# EAGLE design atmega_midi_x0x_heart (EAGLE 7.1.0)
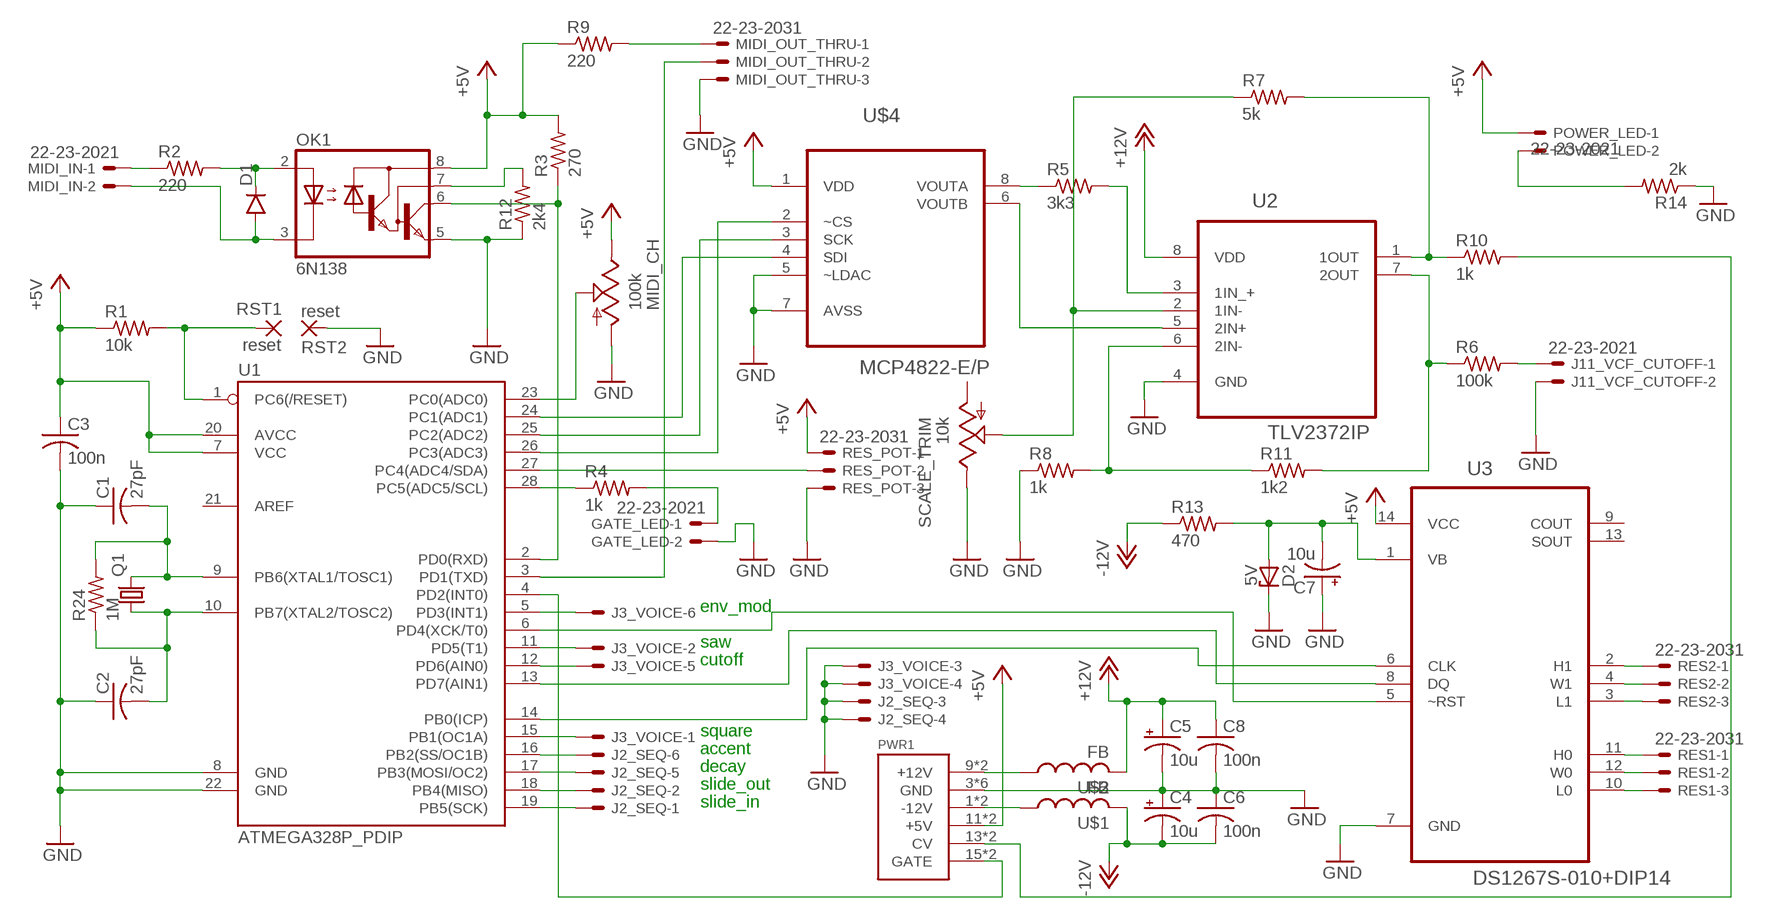
[diagram p0: schematic, sheet 1]

## Parts
C1  27pF  C-US050-024X044  [C050-024X044]
C2  27pF  C-US050-024X044  [C050-024X044]
C3  100n  C-US050-024X044  [C050-024X044]
C4  10u  CPOL-USB45181A  [B45181A]
C5  10u  CPOL-USB45181A  [B45181A]
C6  100n  C-US050-024X044  [C050-024X044]
C7  10u  CPOL-USB45181B  [B45181B]
C8  100n  C-US050-024X044  [C050-024X044]
D1  DIODE1N4148  [DIODE-1N4148]
D2  5V  ZENER-DIODEDO35Z10  [DO35Z10]
GATE_LED  22-23-2021  [22-23-2021]
J2_SEQ  22-23-2061  [22-23-2061]
J3_VOICE  22-23-2061  [22-23-2061]
J11_VCF_CUTOFF  22-23-2021  [22-23-2021]
MIDI_CH  100k  TRIM_US-B64W  [B64W]
MIDI_IN  22-23-2021  [22-23-2021]
MIDI_OUT_THRU  22-23-2031  [22-23-2031]
OK1  6N138  [DIL08]
POWER_LED  22-23-2021  [22-23-2021]
PWR1  POWER  [POWER_16]
Q1  CRYSTALHC49S  [HC49/S]
R1  10k  R-US_0207/10  [0207/10]
R2  220  R-US_0207/10  [0207/10]
R3  270  R-US_0207/10  [0207/10]
R4  1k  R-US_0207/10  [0207/10]
R5  3k3  R-US_0207/10  [0207/10]
R6  100k  R-US_0207/10  [0207/10]
R7  5k  R-US_0207/10  [0207/10]
R8  1k  R-US_0207/10  [0207/10]
R9  220  R-US_0207/10  [0207/10]
R10  1k  R-US_0207/10  [0207/10]
R11  1k2  R-US_0207/10  [0207/10]
R12  2k4  R-US_0207/10  [0207/10]
R13  470  R-US_0207/10  [0207/10]
R14  2k  R-US_0207/10  [0207/10]
R24  1M  R-US_0207/10  [0207/10]
RES1  22-23-2031  [22-23-2031]
RES2  22-23-2031  [22-23-2031]
RES_POT  22-23-2031  [22-23-2031]
RST1  reset  2,54/0,9  [2,54/0,9]
RST2  reset  2,54/0,9  [2,54/0,9]
SCALE_TRIM  10k  TRIM_US-B64W  [B64W]
U1  ATMEGA328P_PDIP  [DIL28-3]
U2  TLV2372IP  [DIP254P762X508-8]
U3  DS1267S-010+DIP14  [DIP14]
U$1  FB  [FB]
U$2  FB  [FB]
U$4  MCP4822-E/P  [DIP254P762X432-8]

## Nets
+5V: C3.1 MIDI_CH.E OK1.8(VCC) POWER_LED.1 PWR1.11(+5V) PWR1.12(+5V) R1.1 R3.2 R9.1 RES_POT.1 U1.7(VCC) U1.20(AVCC) U3.14(VCC) U$4.1(VDD)
+12V: C5.+ C8.1 U2.8(VDD) U$2.P$2
-12V: C4.- C6.2 R13.1 U$1.P$2
GND: C1.1 C2.1 C3.2 C4.+ C5.- C6.1 C7.+ C8.2 D2.C GATE_LED.2 J2_SEQ.3 J2_SEQ.4 J3_VOICE.3 J3_VOICE.4 J11_VCF_CUTOFF.2 MIDI_CH.A MIDI_OUT_THRU.3 OK1.5(GND) PWR1.3(GND) PWR1.4(GND) PWR1.5(GND) PWR1.6(GND) PWR1.7(GND) PWR1.8(GND) R8.1 R12.1 R14.1 RES_POT.3 RST2.1(P) SCALE_TRIM.E U1.8(GND) U1.22(GND) U2.4(GND) U3.7(GND) U$4.5(~LDAC) U$4.7(AVSS)
N$1: J3_VOICE.6 U1.5(PD3(INT1))
N$2: R5.1 U$4.8(VOUTA)
N$3: D1.A MIDI_IN.2 OK1.3(C)
N$4: C1.2 Q1.2 R24.2 U1.9(PB6(XTAL1/TOSC1))
N$5: C2.2 Q1.1 R24.1 U1.10(PB7(XTAL2/TOSC2))
N$6: R5.2 U2.3(1IN_+)
N$7: D1.C OK1.2(A) R2.2
N$8: MIDI_IN.1 R2.1
N$9: J3_VOICE.1 U1.15(PB1(OC1A))
N$10: J3_VOICE.2 U1.11(PD5(T1))
N$11: PWR1.9(+12V) PWR1.10(+12V) U$2.P$1
N$12: R7.1 SCALE_TRIM.S U2.2(1IN-)
N$13: R8.2 R11.1 U2.6(2IN-)
N$14: U2.5(2IN+) U$4.6(VOUTB)
N$15: PWR1.13(CV) PWR1.14(CV) R10.2
N$16: J3_VOICE.5 U1.12(PD6(AIN0))
N$17: R6.1 R11.2 U2.7(2OUT)
N$18: J2_SEQ.1 U1.19(PB5(SCK))
N$19: MIDI_CH.S U1.23(PC0(ADC0))
N$20: J2_SEQ.2 U1.18(PB4(MISO))
N$21: J2_SEQ.5 U1.17(PB3(MOSI/OC2))
N$22: U1.6(PD4(XCK/T0)) U3.5(~RST)
N$23: J2_SEQ.6 U1.16(PB2(SS/OC1B))
N$24: GATE_LED.1 R4.2
N$25: U1.25(PC2(ADC2)) U$4.3(SCK)
N$26: U1.24(PC1(ADC1)) U$4.4(SDI)
N$27: R7.2 R10.1 U2.1(1OUT)
N$28: R4.1 U1.28(PC5(ADC5/SCL))
N$29: J11_VCF_CUTOFF.1 R6.2
N$30: OK1.6(VO) R3.1 U1.2(PD0(RXD))
N$31: RES2.2 U3.4(W1)
N$32: RES2.1 U3.2(H1)
N$33: RES2.3 U3.3(L1)
N$34: RES1.2 U3.12(W0)
N$35: RES1.1 U3.11(H0)
N$36: RES1.3 U3.10(L0)
N$37: U1.14(PB0(ICP)) U3.6(CLK)
N$38: RES_POT.2 U1.27(PC4(ADC4/SDA))
N$39: MIDI_OUT_THRU.1 R9.2
N$40: PWR1.15(GATE) PWR1.16(GATE) U1.4(PD2(INT0))
N$41: U1.13(PD7(AIN1)) U3.8(DQ)
N$42: MIDI_OUT_THRU.2 U1.3(PD1(TXD))
N$43: R1.2 RST1.1(P) U1.1(PC6(/RESET))
N$44: OK1.7(VB) R12.2
N$45: U1.26(PC3(ADC3)) U$4.2(~CS)
N$46: POWER_LED.2 R14.2
N$47: PWR1.1(-12V) PWR1.2(-12V) U$1.P$1
N$49: C7.- D2.A R13.2 U3.1(VB)
Unconnected: SCALE_TRIM.A U1.21(AREF) U3.9(COUT) U3.13(SOUT)

## Notes on the sheet
- env_mod
- saw
- cutoff
- square
- accent
- decay
- slide_out
- slide_in

## Library data of the parts
C1-C3 C6 C8 = rcl:C-US: CAPACITOR, American symbol
C4 C5 C7 = rcl:CPOL-US: POLARIZED CAPACITOR, American symbol
D1 = SparkFun-DiscreteSemi:DIODE: Diode These are standard reverse protection diodes and small signal diodes. SMA package can handle up to about 1A. SOD-323 can handle about 200mA. What the SOD-323 package when ordering, there are some mfgs out there that are 5-pin packages.
D2 = diode:ZENER-DIODE: Z-Diode
GATE_LED J11_VCF_CUTOFF MIDI_IN POWER_LED = con-molex:22-23-2021: .100" (2.54mm) Center Header - 2 Pin; MF: MOLEX; MPN: 22-23-2021; OC_FARNELL: 1462926; OC_NEWARK: 25C3832
J2_SEQ J3_VOICE = con-molex:22-23-2061: .100" (2.54mm) Center Header - 6 Pin; MF: MOLEX; MPN: 22-23-2061; OC_FARNELL: 1462922; OC_NEWARK: 27C1933
MIDI_CH SCALE_TRIM = pot:TRIM_US-: POTENTIOMETER
MIDI_OUT_THRU RES1 RES2 RES_POT = con-molex:22-23-2031: .100" (2.54mm) Center Header - 3 Pin; MF: MOLEX; MPN: 22-23-2031; OC_FARNELL: 1462950; OC_NEWARK: 30C0862
OK1 = optocoupler:6N138: MOTOROLA OPTO COUPLER; MF: VISHAY/TELEFUNKEN; MPN: 6N138; OC_FARNELL: 9860150; OC_NEWARK: 35K5294
PWR1 = eurorack:POWER
Q1 = crystal:CRYSTAL: CRYSTAL; OC_FARNELL: 1667008; OC_NEWARK: unknown
R1-R14 R24 = rcl:R-US_: RESISTOR, American symbol
RST1 RST2 = wirepad:2,54/0,9: THROUGH-HOLE PAD
U1 = SparkFun-DigitalIC:ATMEGA328P_PDIP: uC used in the Arduino 32kb flash, 1k EEPROM, 2k SRAM This is the through-hole version of this chip.
U2 = Texas Instruments_By_element14_Batch_1:TLV2372IP: OPERATIONAL AMPLIFIER; MPN: TLV2372IP; OC_FARNELL: 8455031; OC_NEWARK: 76C7976; PACKAGE: PDIP; SUPPLIER: Texas Instruments
U3 = Maxim_By_element14_Batch_1:DS1267S-010+: Dual Digital Potentiometer Chip
U$1 U$2 = adafruit:FB: Ferrite bead Digikey #P9821BK-ND
U$4 = MCP4822:MCP4822-E/P: DAC; MPN: MCP4822-E/P; OC_FARNELL: 1439413; OC_NEWARK: 11M1705; PACKAGE: DIP-8; SUPPLIER: Microchip

## Net classes
1 GND: width 1.016 mm, drill 1.016 mm, clearance 0.508 mm

## Board
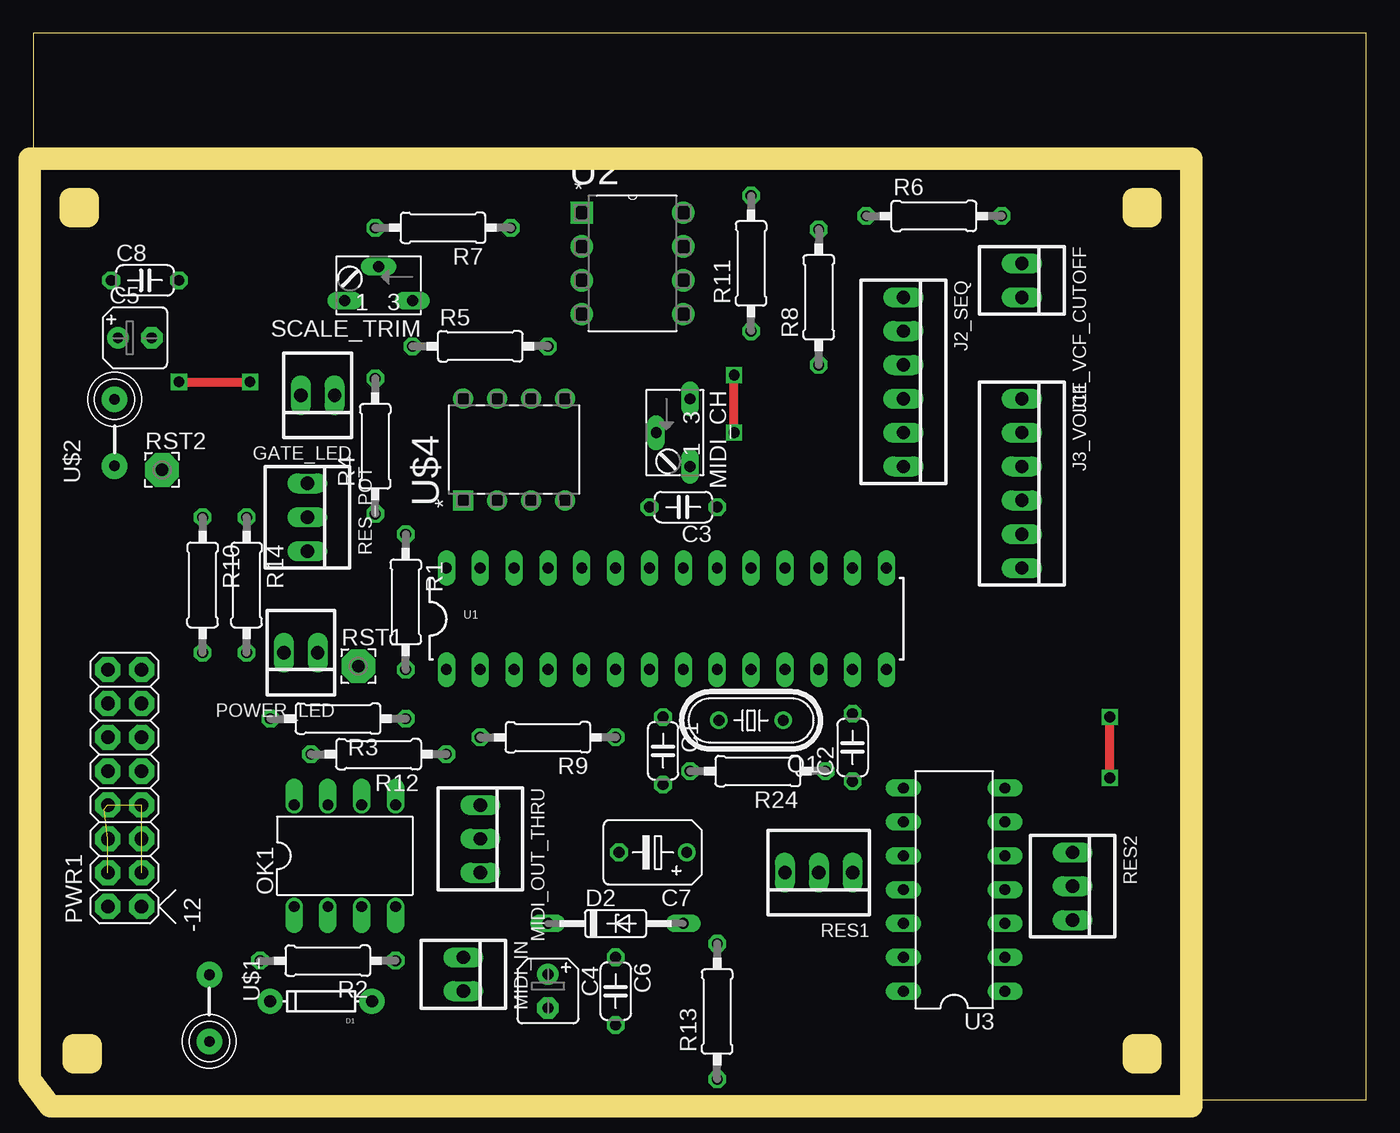
[diagram p1: board, top side]
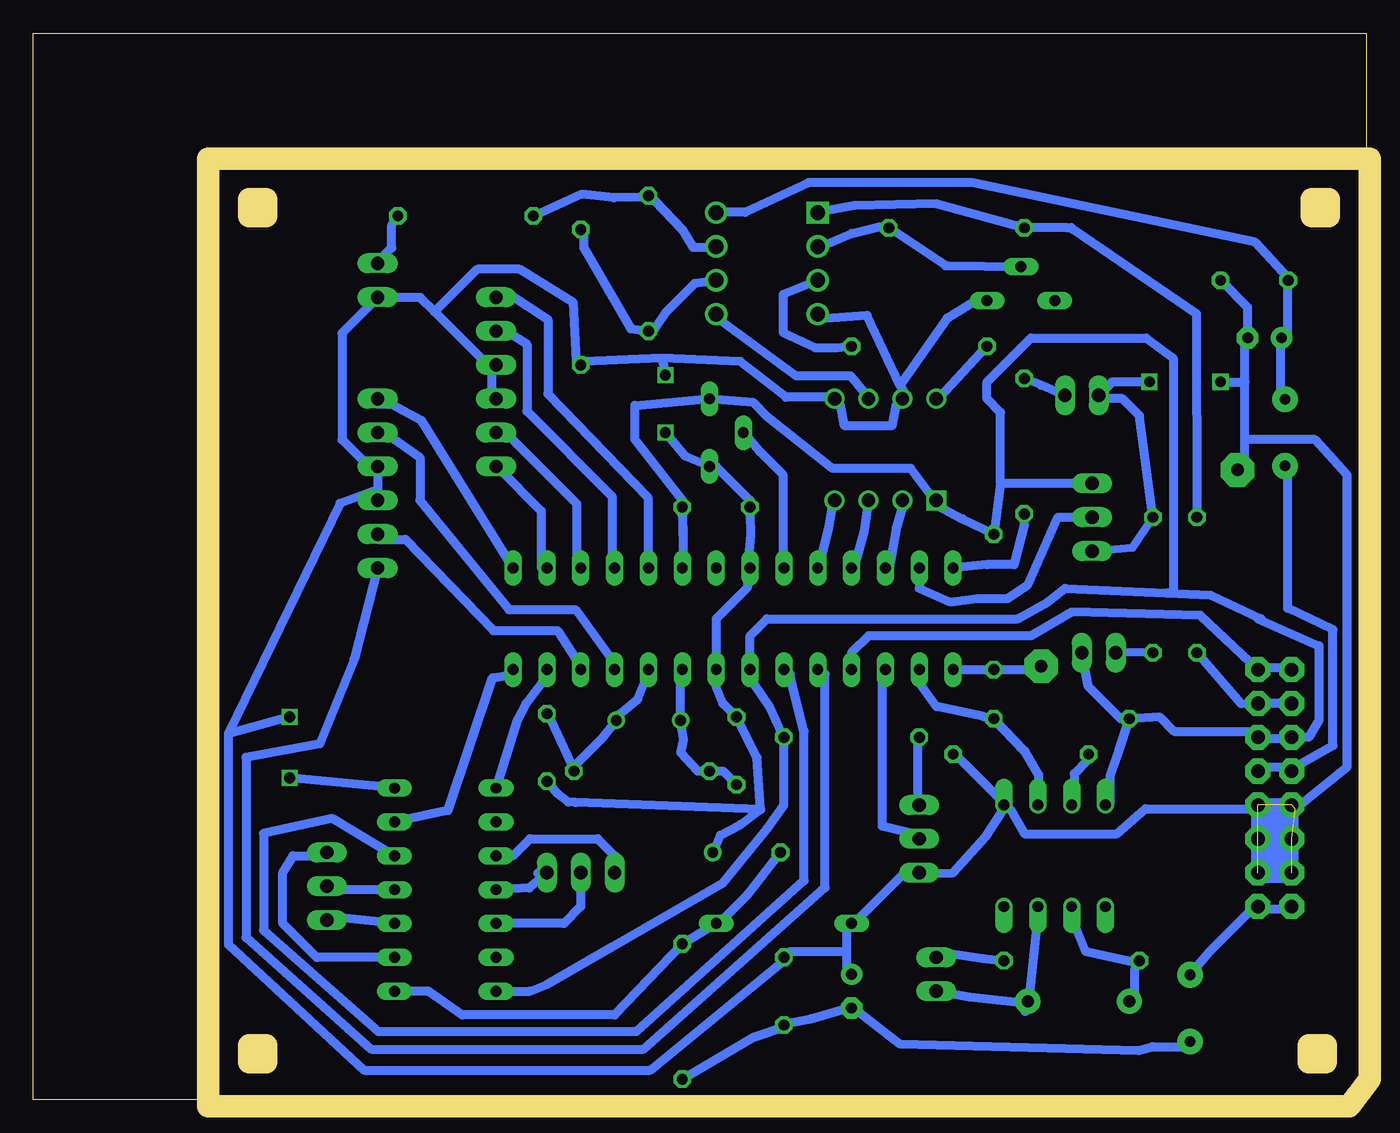
[diagram p2: board, bottom side, seen from below]

Size 100 x 80 mm. Coordinates in mm from the lower left corner, seen from the top.
Outline: 0,0 100,0 100,80 0,80 0,0
Copper layers (1*16): Top 0.035mm / dielectric 1.5mm / Bottom 0.035mm
Design rules "default *": minimum track width 26mil, minimum drill 31mil, track to track 16mil, track to pad 16mil, pad to pad 16mil, via to via 16mil, smd to smd 8mil, copper to edge 0mil, drill to drill 16mil, minimum pad ring 10mil, minimum via ring 8mil, stop-mask expansion 4mil, vias tented up to drill 0mil, thermal gap 12mil
Milling: 21 lines

### Footprints (pad centres in the part's own frame; a part is rotated, then mirrored left to right if it is on the bottom)
C050-024X044 = drill 0.813 octagon: 1 -2.54,0; 2 2.54,0
B45181A = drill 0.813 pad 1.6: + -1.27,0 | drill 0.813 pad 1.6 octagon: - 1.27,0
B45181B = drill 0.813: + -2.54,0 | drill 0.813 octagon: - 2.54,0
DIODE-1N4148 = drill 0.9 pad 1.88: A -3.81,0; C 3.81,0
DO35Z10 = drill 0.813 long: A 5.08,0; C -5.08,0
22-23-2021 = drill 1 long: 1 -1.27,0; 2 1.27,0
22-23-2061 = drill 1 long: 1 -6.35,0; 2 -3.81,0; 3 -1.27,0; 4 1.27,0; 5 3.81,0; 6 6.35,0
B64W = drill 0.813 long: A 2.54,0; E -2.54,0; S 0,-2.54
22-23-2031 = drill 1 long: 1 -2.54,0; 2 0,0; 3 2.54,0
DIL08 = drill 0.813 offset: 1 -3.81,-3.81; 2 -1.27,-3.81; 3 1.27,-3.81; 4 3.81,-3.81; 5 3.81,3.81; 6 1.27,3.81; 7 -1.27,3.81; 8 -3.81,3.81
POWER_16 = drill 1.016 pad 1.88 octagon: 1 -6.35,-1.27; 2 -6.35,1.27; 3 -3.81,-1.27; 4 -3.81,1.27; 5 -1.27,-1.27; 6 -1.27,1.27; 7 1.27,-1.27; 8 1.27,1.27; 9 3.81,-1.27; 10 3.81,1.27; 11 6.35,-1.27; 12 6.35,1.27; 13 8.89,-1.27; 14 8.89,1.27; 15 11.43,-1.27; 16 11.43,1.27
HC49/S = drill 0.813: 1 -2.413,0; 2 2.413,0
0207/10 = drill 0.813 octagon: 1 -5.08,0; 2 5.08,0
2,54/0,9 = drill 0.914 pad 2.54 octagon: 1 0,0
DIL28-3 = drill 0.813 long: 1 -16.51,-3.81; 2 -13.97,-3.81; 3 -11.43,-3.81; 4 -8.89,-3.81; 5 -6.35,-3.81; 6 -3.81,-3.81; 7 -1.27,-3.81; 8 1.27,-3.81; 9 3.81,-3.81; 10 6.35,-3.81; 11 8.89,-3.81; 12 11.43,-3.81; 13 13.97,-3.81; 14 16.51,-3.81; 15 16.51,3.81; 16 13.97,3.81; 17 11.43,3.81; 18 8.89,3.81; 19 6.35,3.81; 20 3.81,3.81; 21 1.27,3.81; 22 -1.27,3.81; 23 -3.81,3.81; 24 -6.35,3.81; 25 -8.89,3.81; 26 -11.43,3.81; 27 -13.97,3.81; 28 -16.51,3.81
DIP254P762X508-8 = drill 1.118 square: 1 -7.62,7.62 | drill 1.118: 2 -7.62,5.08; 3 -7.62,2.54; 4 -7.62,0; 5 0,0; 6 0,2.54; 7 0,5.08; 8 0,7.62
DIP14 = drill 0.813 long: 1 -7.62,-3.81; 2 -5.08,-3.81; 3 -2.54,-3.81; 4 0,-3.81; 5 2.54,-3.81; 6 5.08,-3.81; 7 7.62,-3.81; 8 7.62,3.81; 9 5.08,3.81; 10 2.54,3.81; 11 0,3.81; 12 -2.54,3.81; 13 -5.08,3.81; 14 -7.62,3.81
FB = drill 0.8 pad 1.93: P$1 -2.5,0; P$2 2.5,0
DIP254P762X432-8 = drill 0.991 square: 1 -7.62,7.62 | drill 0.991: 2 -7.62,5.08; 3 -7.62,2.54; 4 -7.62,0; 5 0,0; 6 0,2.54; 7 0,5.08; 8 0,7.62

### Placement (x,y rotation side)
C1  47.24,26.16 270 top
C2  61.47,26.42 90 top
C3  48.77,44.45 180 top
C4  38.61,8.13 270 top
C5  7.62,57.15 0 top
C6  43.69,8.13 270 top
C7  46.48,18.54 180 top
C8  8.38,61.47 0 top
D1  21.59,7.37 180 top
D2  43.69,13.21 0 top
GATE_LED  21.34,52.83 180 top
J2_SEQ  65.28,53.85 270 top
J3_VOICE  74.17,46.23 270 top
J11_VCF_CUTOFF  74.17,61.47 270 top
MIDI_CH  49.28,50.04 270 top
MIDI_IN  32.26,9.4 270 top
MIDI_OUT_THRU  33.53,19.56 270 top
OK1  23.37,18.29 0 top
POWER_LED  20.07,33.53 180 top
PWR1  6.86,20.83 90 top
Q1  53.85,28.45 180 top
R1  27.94,37.34 270 top
R2  22.1,10.41 180 top
R3  22.86,28.57 180 top
R4  25.65,49.02 90 top
R5  33.53,56.52 0 top
R6  67.56,66.29 0 top
R7  30.73,65.41 180 top
R8  58.93,60.2 90 top
R9  38.61,27.18 180 top
R10  12.7,38.61 270 top
R11  53.85,62.74 90 top
R12  25.91,25.91 180 top
R13  51.31,6.6 90 top
R14  16,38.61 270 top
R24  54.36,24.64 180 top
RES1  58.93,17.02 180 top
RES2  77.98,16 270 top
RES_POT  20.57,43.69 270 top
RST1  24.38,32.51 0 top
RST2  9.65,47.24 0 top
SCALE_TRIM  25.91,59.94 180 top
U1  47.5,36.07 0 top
U2  48.77,58.93 0 top
U3  69.09,15.75 90 top
U$1  13.21,6.86 270 top
U$2  6.1,50.04 90 top
U$4  39.88,52.58 90 top

### Tracks (layer width: path | path; a pad name or v marks a point on that pad's centre or on a via)
+5V
  Bottom 0.66: 51.26,42.39 51.26,39.65 U1.20 | 51.26,42.39 51.28,43.69 C3.1 | OK1.8 19.23,22.3 19.23,24.23 18.57,26.16 R3.2 | R3.2 15.49,28.7 14.43,27.64 8.56,27.64 PWR1.11 8.03,27.1 5.89,27.1 PWR1.12 4.32,27.18 3.56,28.45 3.56,34.04 8.13,36.07 7.87,36.07 11.68,37.85 14.97,38 | U3.14 62.74,8.13 61.47,8.64 56.64,11.43 48.26,16.26 44.96,20.32 43.69,22.1 R9.1 43.76,27.13 44.3,28.42 44.81,29.52 46.43,31.9 U1.7 46.23,34.8 44.96,36.07 26.16,36.07 23.88,37.34 22.61,38.35 14.97,38 | RES_POT.1 27.43,46.23 | 27.43,46.23 R1.1 30.28,43.56 32.18,44.58 32.03,45.24 U$4.1 32.56,45.24 34.16,47.35 40.03,47.35 44.96,51.26 46.02,52.32 MIDI_CH.E 54.86,52.07 54.86,49.53 51.26,44.91 51.26,42.39 | R3.2 18.41,28.57 20.83,30.99 POWER_LED.1 | 14.97,38 14.48,38.02 14.48,55.63 16.51,57.15 25.15,57.15 28.45,53.85 28.45,52.58 27.43,51.56 27.43,46.23
+12V
  Bottom 0.66: U2.8 48.56,66.57 46.58,66.57 41.81,68.81 29.59,68.81 8.33,64.31 5.79,61.59 5.87,61.52 C8.1 5.89,61.24 5.89,57.51 C5.+ 6.43,56.97 6.43,52.7 U$2.P$2
-12V
  Bottom 0.66: R13.1 45.9,4.7 43.59,5.49 43.76,5.23 C6.2 43.23,5.77 41.66,6.07 38.96,6.83 C4.- 38.43,6.83 35.03,4.19 17.07,3.68 16.03,3.96 13.36,3.96 U$1.P$2
GND  (via drill 0.8)  (6 unrouted)
  Top 0.66: v80.77,24.13 v80.77,28.7 | v52.58,50.04 v52.58,54.36 | v10.92,53.85 v16.26,53.85
  Bottom 0.61: R14.1 17.53,41.4 RES_POT.3 | 9.4,47.5 9.4,46.53 | 19.56,52.58 GATE_LED.2
  Bottom 0.66: 9.09,49.51 9.09,46.84 9.4,46.53 9.63,46.3 RST2.1 | 9.09,49.51 9.09,53.85 | 9.09,53.85 9.09,56.97 C5.- 8.89,59.44 C8.2 | OK1.5 27.23,22.3 30.96,26.04 R12.1 | 38.96,11.1 38.96,9.5 C4.+ | 38.96,11.1 38.96,12.7 D2.C 38.43,13.23 34.7,16.97 33.63,16.97 MIDI_OUT_THRU.3 33.1,16.97 32.31,16.97 30.99,17.02 28.55,19.74 27.23,21.77 OK1.5 | 38.96,11.1 43.23,11.1 C6.1 43.76,10.57 43.81,10.31 53.7,2.21 75.18,2.21 85.37,11.63 85.37,27.43 | 9.09,49.51 3.83,49.51 1.42,46.84 1.42,24.97 5.33,21.82 16.56,21.82 18.69,19.94 25.63,19.94 26.7,21.77 OK1.5 | 46.43,39.9 46.18,42.37 46.23,43.94 C3.2 46.23,44.96 48.77,47.5 MIDI_CH.A 51.05,48.26 v52.58,50.04 | 46.43,39.9 U1.22 | 45.44,21.77 46.97,20.62 48.46,19.84 C7.+ | 45.44,21.77 45.7,25.65 C1.1 48.26,29.72 48.77,30.99 U1.8 | 45.44,21.77 59.31,22.28 59.87,22.33 60.63,22.91 C2.1 | 48.56,31.9 U1.8 | 74.17,45.77 J3_VOICE.3 74.17,47.9 75.23,47.9 76.83,49.51 76.83,57.51 74.17,60.17 | 74.17,45.77 J3_VOICE.4 | 65.63,54.84 65.63,52.7 J2_SEQ.4 | 74.17,60.17 70.97,60.17 69.9,59.11 | 65.63,54.84 69.9,59.11 | 65.63,54.84 J2_SEQ.3 | 74.17,60.17 J11_VCF_CUTOFF.2 | 52.83,55.63 46.97,55.37 43.54,52.7 40.03,52.7 U$4.5 39.5,52.17 39.17,50.57 35.56,50.57 35.23,52.17 U$4.7 34.72,53.21 34.98,53.57 | 52.83,55.63 58.7,55.37 R8.1 59.23,55.37 59.49,59.79 63.52,62.31 66.7,62.31 69.9,59.11 | 34.98,53.57 37.44,58.83 41.1,58.57 U2.4 | 34.98,53.57 31.42,58.65 28.96,60.17 SCALE_TRIM.E | 85.37,27.43 76.99,44.73 74.17,45.77 | R14.1 17.02,51.31 18.29,52.58 19.56,52.58 | U3.7 v80.77,24.13 | v80.77,28.7 85.37,27.43 | 46.43,39.9 46.43,38.41 48.77,36.07 U1.8 | 52.83,55.63 v52.58,54.36
  Bottom 0.66: v16.26,53.85 19.05,53.85 GATE_LED.2 | v10.92,53.85 9.09,53.85
N$1
  Bottom 0.66: J3_VOICE.6 75.95,33.02 78.51,26.7 84.05,25.68 84.05,12.17 74.65,3.79 54.23,3.79 40.59,15.9 40.59,31.9 U1.5
N$2
  Bottom 0.66: R5.1 32.03,52.68 U$4.8
N$3
  Bottom 0.66: 25.32,7.16 25.58,6.6 D1.A | 25.32,7.16 24.56,14.3 OK1.3 | 25.32,7.16 29.74,7.67 MIDI_IN.2
N$4
  Bottom 0.66: U1.9 51.44,32.13 Q1.2 51.23,27.1 51.44,26.04 50.16,24.64 R24.2 48.26,24.64 C1.2
N$5
  Bottom 0.66: 59.16,25.27 59.54,24.64 R24.1 | 59.16,25.27 57.33,27.1 Q1.1 56.03,28.91 54.66,30.02 53.9,31.9 U1.10 | 59.16,25.27 59.44,24.77 61.37,28.98 C2.2
N$6
  Bottom 0.66: R5.2 39.73,56.41 41.33,56.41 43.74,57.56 43.74,60.4 41.63,61.24 U2.3
N$7
  Bottom 0.66: D1.C 17.35,7.62 17.35,9.8 R2.2 17.6,10.34 21.03,11.1 21.89,13.23 21.89,14.3 OK1.2
N$8
  Bottom 0.66: R2.1 28.75,10.59 32.03,11.1 MIDI_IN.1
N$9
  Bottom 0.66: U1.15 64.03,39.9 70.89,50.98 73.1,52.17 74.17,52.17 J3_VOICE.1
N$10
  Bottom 0.66: J3_VOICE.2 73.64,50.04 70.99,48.16 70.99,44.96 64.31,36.75 59.33,36.75 56.57,32.97 56.57,32.44 U1.11
N$11
  Bottom 0.66: PWR1.9 8.03,24.97 5.89,24.97 PWR1.10 5.36,24.97 2.49,26.57 2.49,35.26 5.89,36.88 5.89,47.37 U$2.P$1
N$12
  Bottom 0.66: U2.2 41.1,63.91 38.61,64.97 36.52,65.48 R7.1 31.55,62.56 31.37,62.56 SCALE_TRIM.S
N$13
  Bottom 0.66: U2.6 50.37,61.24 52.5,59.11 53.37,57.84 R11.1 55.17,57.84 58.7,63.91 58.7,64.97 R8.2
N$14
  Bottom 0.66: U$4.6 37.36,52.7 38.71,54.3 42.77,54.3 48.56,58.57 U2.5
N$15
  Bottom 0.61: 9.4,29.72 PWR1.13
  Bottom 0.66: PWR1.14 5.89,29.77 8.03,29.77 PWR1.13 | R10.2 9.4,29.72
N$16
  Bottom 0.66: U1.12 59.23,32.44 59.23,32.97 60.68,35.18 65.48,35.18 72.08,42.04 74.17,42.04 J3_VOICE.5
N$17
  Bottom 0.66: U2.7 49.1,63.93 50.47,63.93 51.31,65.28 53.37,67.44 R11.2 53.9,67.69 56.46,67.67 58.88,67.92 R6.1
N$18
  Bottom 0.66: U1.19 53.9,39.9 53.9,45.19 61.39,52.93 61.39,58.52 64.34,60.45 J2_SEQ.1
N$19
  Bottom 0.66: U1.23 43.76,39.9 43.76,46.89 45.49,48.62 46.58,49.89 MIDI_CH.S
N$20
  Bottom 0.66: U1.18 56.57,39.9 56.57,45.24 62.97,51.64 62.97,56.67 65.1,58.04 J2_SEQ.2
N$21
  Bottom 0.66: J2_SEQ.5 64.57,50.04 59.23,44.7 59.23,39.9 U1.17
N$22
  Bottom 0.66: U1.6 43.23,31.9 42.98,30.73 42.16,27.64 42.16,16.43 54.76,5.11 74.12,5.11 82.73,12.7 82.73,19.96 77.55,21.08 U3.5
N$23
  Bottom 0.66: U1.16 61.9,39.9 61.9,44.17 65.1,47.37 J2_SEQ.6
N$24
  Bottom 0.66: GATE_LED.1 24.38,53.59 R4.2
N$25
  Bottom 0.66: U1.25 38.43,39.9 37.67,42.62 37.36,44.7 U$4.3
N$26
  Bottom 0.66: U1.24 41.1,39.9 40.34,42.88 40.03,44.7 U$4.4
N$27
  Bottom 0.66: R10.1 12.72,58.95 22.02,65.3 22.15,65.43 22.53,65.43 R7.2 32.21,67.21 38.43,67.08 41.1,66.57 U2.1
N$28
  Bottom 0.61: R4.1 25.65,43.18
  Bottom 0.66: 25.65,43.18 26.42,40.13 28.45,40.13 U1.28
N$29
  Bottom 0.66: R6.2 73.1,65.61 73.1,63.91 74.17,62.84 J11_VCF_CUTOFF.1
N$30
  Bottom 0.66: OK1.6 24.59,22.3 24.59,24.36 25.63,26.16 R3.1 28.7,28.73 32.23,29.49 33.6,31.37 33.6,31.9 U1.2
N$31
  Bottom 0.66: U3.4 76.71,15.75 77.47,16 RES2.2
N$32
  Bottom 0.66: U3.2 78.74,10.67 81.28,13.21 81.28,17.02 80.52,18.29 78.23,18.29 RES2.1
N$33
  Bottom 0.66: U3.3 77.72,13.72 RES2.3
N$34
  Bottom 0.66: RES1.2 58.93,14.48 60.2,13.21 U3.12
N$35
  Bottom 0.66: U3.11 62.79,15.88 61.59,16.84 62.15,16.99 RES1.1
N$36
  Bottom 0.66: U3.10 64.01,18.29 62.74,19.56 57.66,19.56 56.39,18.29 RES1.3
N$37
  Bottom 0.66: U1.14 64.03,31.9 65.53,31.65 68.89,21.69 U3.6
N$38
  Bottom 0.66: U1.27 33.53,38.35 31.24,37.34 29.21,37.59 26.92,37.59 25.4,38.61 23.11,43.69 RES_POT.2
N$39
  Bottom 0.66: R9.2 33.63,27.1 33.63,22.3 MIDI_OUT_THRU.1
N$40
  Bottom 0.66: PWR1.16 5.89,32.44 8.03,32.44 PWR1.15 12.45,36.32 22.1,36.58 25.15,34.8 37.34,34.8 38.61,33.53 U1.4
N$41
  Bottom 0.66: U3.8 63.7,28.45 63.04,29.72 61.37,31.9 U1.13
N$42
  Bottom 0.66: U1.3 36.3,31.9 36.3,20.5 33.63,19.86 MIDI_OUT_THRU.2
N$43
  Bottom 0.66: U1.1 R1.2 24.64,32.26 RST1.1
N$44
  Bottom 0.66: OK1.7 21.89,22.3 21.89,24.43 20.83,25.5 R12.2
N$45
  Bottom 0.66: U1.26 35.76,39.9 35.26,42.9 34.72,44.7 U$4.2
N$46
  Bottom 0.61: R14.2 POWER_LED.2
N$47
  Bottom 0.66: PWR1.2 5.89,14.3 8.03,14.3 PWR1.1 8.56,14.3 11.76,11.1 12.83,9.83 U$1.P$1
N$49
  Bottom 0.66: C7.- 46.43,15.37 48.56,13.23 D2.A R13.2 56.39,6.35 67.82,6.35 70.36,8.13 U3.1
(copper drawn outside any net)
  shapes: Bottom area x1